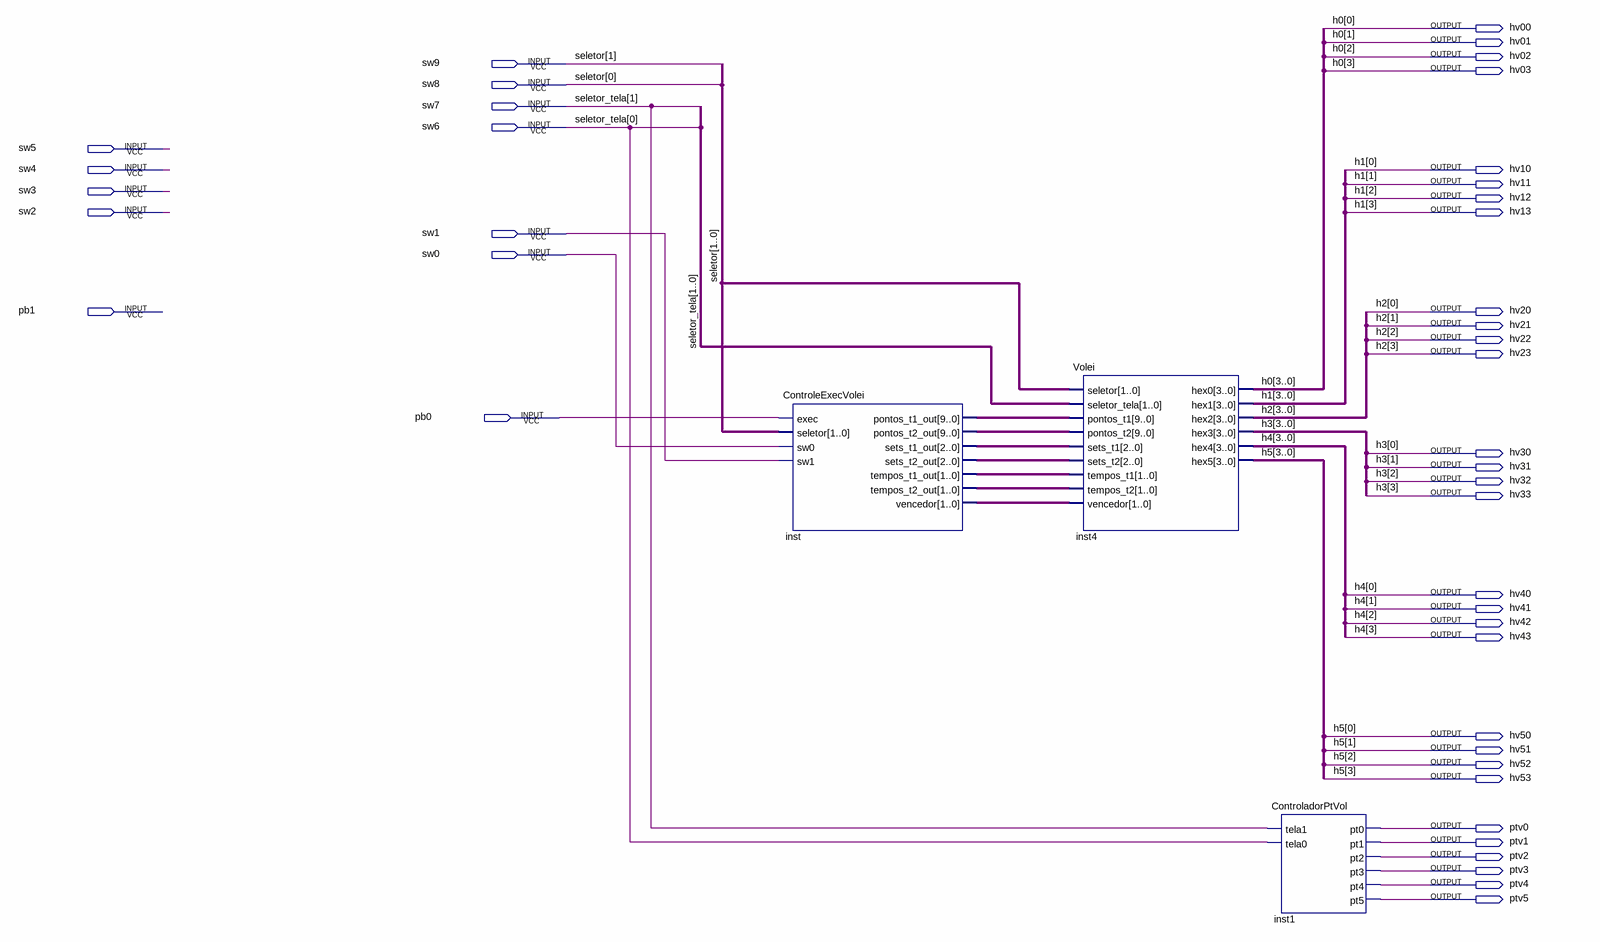
[diagram p0: schematic sheet]
// Quartus schematic ControleVolei.bdf as structural Verilog: 3 symbols, 42 pins
module ControleVolei (
  input  sw9,
  input  sw8,
  input  sw7,
  input  sw6,
  input  sw5,
  input  sw4,
  input  sw3,
  input  sw2,
  input  sw1,
  input  sw0,
  input  pb1,
  input  pb0,
  output hv00,
  output hv01,
  output hv02,
  output hv03,
  output hv10,
  output hv11,
  output hv12,
  output hv13,
  output hv20,
  output hv21,
  output hv22,
  output hv23,
  output hv30,
  output hv31,
  output hv32,
  output hv33,
  output hv40,
  output hv41,
  output hv42,
  output hv43,
  output hv50,
  output hv51,
  output hv52,
  output hv53,
  output ptv0,
  output ptv1,
  output ptv2,
  output ptv3,
  output ptv4,
  output ptv5
);

  wire [1:0] inst_tempos_t1_out, inst_tempos_t2_out, inst_vencedor;
  wire [2:0] inst_sets_t1_out, inst_sets_t2_out;
  wire [9:0] inst_pontos_t1_out, inst_pontos_t2_out;

  ControleExecVolei inst (
    .exec(pb0), .seletor({sw9, sw8}), .sw0(sw0), .sw1(sw1), .pontos_t1_out(inst_pontos_t1_out),
    .pontos_t2_out(inst_pontos_t2_out), .sets_t1_out(inst_sets_t1_out), .sets_t2_out(inst_sets_t2_out),
    .tempos_t1_out(inst_tempos_t1_out), .tempos_t2_out(inst_tempos_t2_out), .vencedor(inst_vencedor));
  Volei inst4 (
    .seletor({sw9, sw8}), .seletor_tela({sw7, sw6}), .pontos_t1(inst_pontos_t1_out),
    .pontos_t2(inst_pontos_t2_out), .sets_t1(inst_sets_t1_out), .sets_t2(inst_sets_t2_out),
    .tempos_t1(inst_tempos_t1_out), .tempos_t2(inst_tempos_t2_out), .vencedor(inst_vencedor),
    .hex0({hv03, hv02, hv01, hv00}), .hex1({hv13, hv12, hv11, hv10}), .hex2({hv23, hv22, hv21, hv20}),
    .hex3({hv33, hv32, hv31, hv30}), .hex4({hv43, hv42, hv41, hv40}), .hex5({hv53, hv52, hv51, hv50}));
  ControladorPtVol inst1 (
    .tela1(sw7), .tela0(sw6), .pt0(ptv0), .pt1(ptv1), .pt2(ptv2), .pt3(ptv3), .pt4(ptv4), .pt5(ptv5));

  // Other names for the same wires on the sheet: h0[3:0] = {hv03, hv02, hv01, hv00};
  //   h1[3:0] = {hv13, hv12, hv11, hv10}; h2[3:0] = {hv23, hv22, hv21, hv20}; h3[3:0] = {hv33, hv32, hv31, hv30};
  //   h4[3:0] = {hv43, hv42, hv41, hv40}; h5[3:0] = {hv53, hv52, hv51, hv50}; seletor[1:0] = {sw9, sw8};
  //   seletor_tela[1:0] = {sw7, sw6}
endmodule
